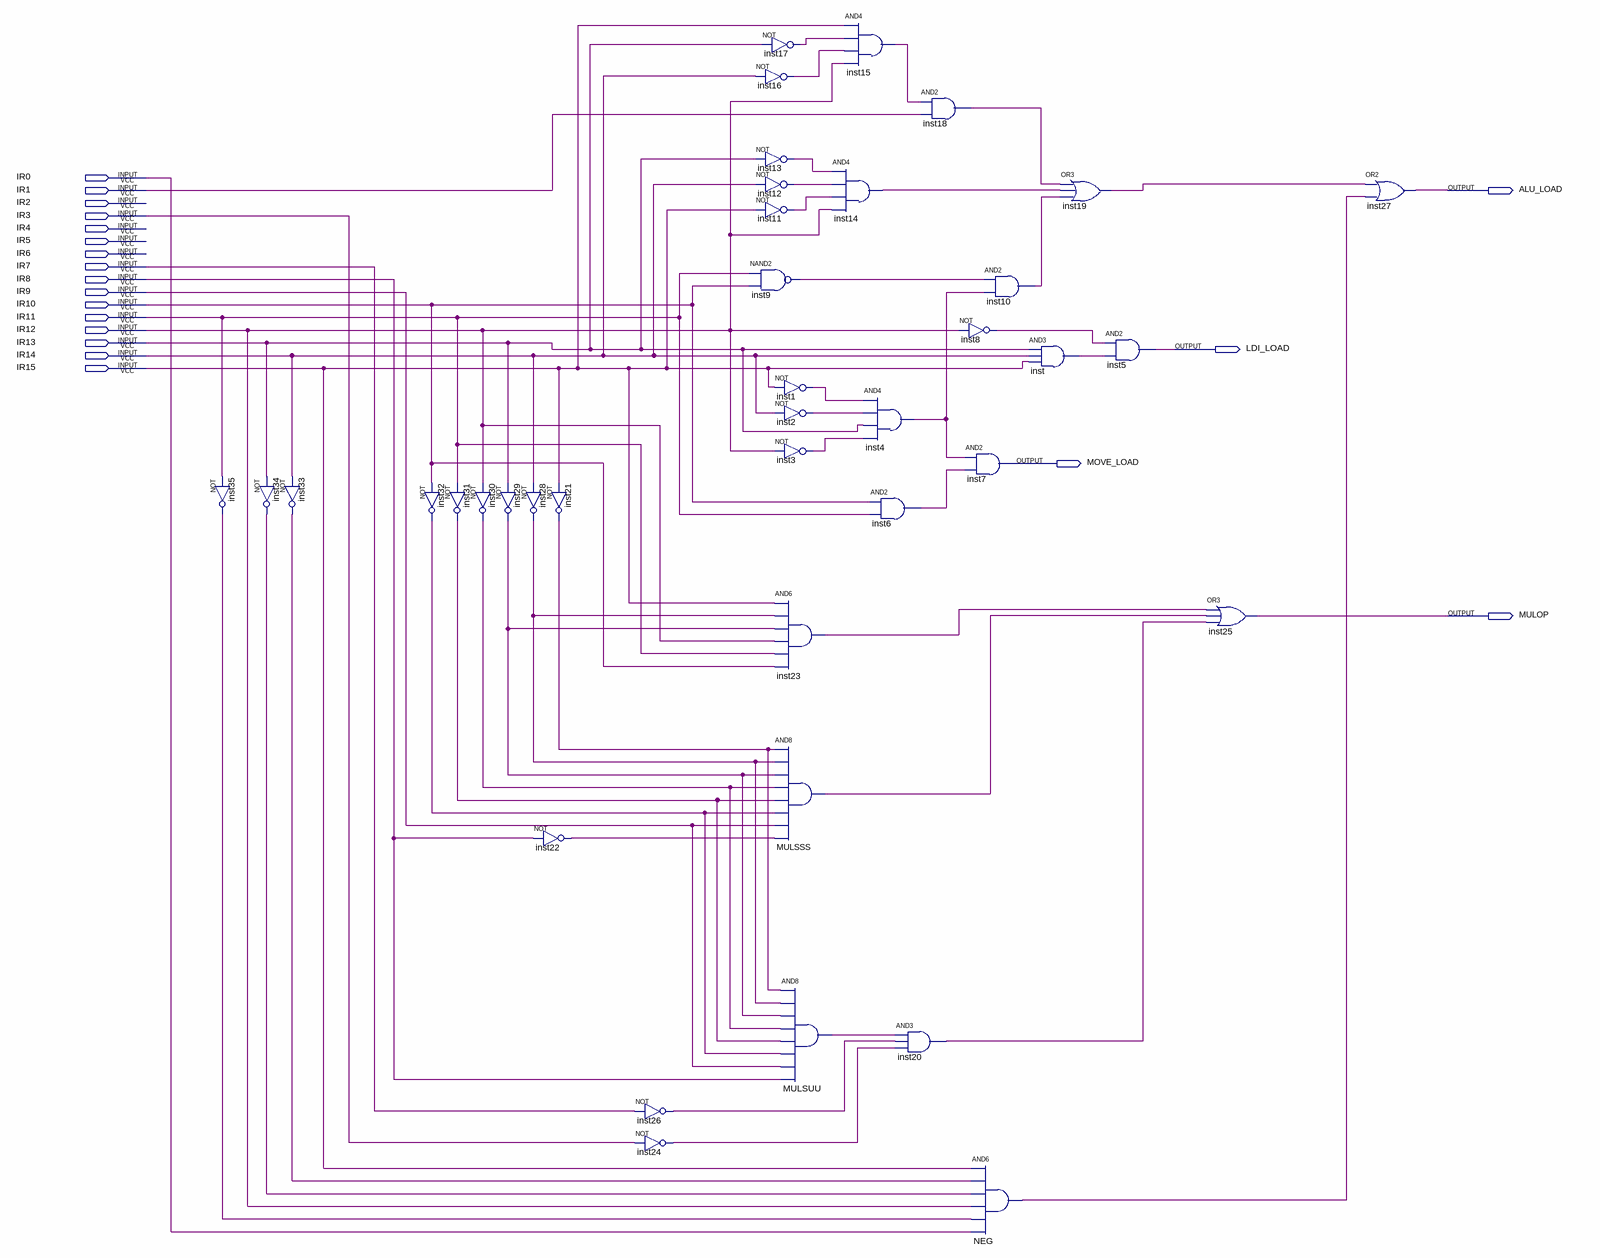
[diagram p0: schematic sheet]
// Quartus schematic LOAD_SELECT.bdf as structural Verilog: 39 symbols, 20 pins
module LOAD_SELECT (
  input  IR0,
  input  IR1,
  input  IR2,
  input  IR3,
  input  IR4,
  input  IR5,
  input  IR6,
  input  IR7,
  input  IR8,
  input  IR9,
  input  IR10,
  input  IR11,
  input  IR12,
  input  IR13,
  input  IR14,
  input  IR15,
  output ALU_LOAD,
  output LDI_LOAD,
  output MOVE_LOAD,
  output MULOP
);

  wire inst1_out, inst2_out, inst3_out, inst4_out, inst6_out, inst8_out, inst9_out, inst10_out, inst11_out,
       inst12_out, inst13_out, inst14_out, inst15_out, inst16_out, inst17_out, inst18_out, inst19_out,
       inst20_out, inst21_out, inst22_out, inst23_out, inst24_out, inst26_out, inst28_out, inst29_out,
       inst30_out, inst31_out, inst32_out, inst33_out, inst34_out, inst35_out, inst_out, MULSSS_out,
       MULSUU_out, NEG_out;

  not inst35 (inst35_out, IR11);
  not inst33 (inst33_out, IR14);
  not inst34 (inst34_out, IR13);
  not inst31 (inst31_out, IR11);
  not inst32 (inst32_out, IR10);
  not inst29 (inst29_out, IR13);
  not inst30 (inst30_out, IR12);
  not inst21 (inst21_out, IR15);
  not inst28 (inst28_out, IR14);
  not inst22 (inst22_out, IR8);
  not inst26 (inst26_out, IR7);
  not inst24 (inst24_out, IR3);
  not inst16 (inst16_out, IR14);
  not inst13 (inst13_out, IR13);
  not inst12 (inst12_out, IR14);
  not inst11 (inst11_out, IR15);
  nand inst9 (inst9_out, IR11, IR10);
  not inst17 (inst17_out, IR13);
  not inst1 (inst1_out, IR15);
  not inst2 (inst2_out, IR14);
  not inst3 (inst3_out, IR12);
  and inst23 (inst23_out, IR15, inst28_out, inst29_out, IR12, IR11, IR10);
  and MULSSS (MULSSS_out, inst21_out, inst28_out, inst29_out, inst30_out, inst31_out, inst32_out, IR9, inst22_out);
  and MULSUU (MULSUU_out, inst21_out, inst28_out, inst29_out, inst30_out, inst31_out, inst32_out, IR9, IR8);
  and inst15 (inst15_out, IR15, inst17_out, inst16_out, IR12);
  and inst14 (inst14_out, inst13_out, inst12_out, inst11_out, IR12);
  and inst4 (inst4_out, inst1_out, inst2_out, IR13, inst3_out);
  and inst6 (inst6_out, IR10, IR11);
  and inst20 (inst20_out, MULSUU_out, inst26_out, inst24_out);
  and inst18 (inst18_out, inst15_out, IR1);
  not inst8 (inst8_out, IR12);
  and inst10 (inst10_out, inst9_out, inst4_out);
  and inst7 (MOVE_LOAD, inst4_out, inst6_out);
  and NEG (NEG_out, IR15, inst33_out, inst34_out, IR12, inst35_out, IR0);
  or inst19 (inst19_out, inst18_out, inst14_out, inst10_out);
  and inst (inst_out, IR13, IR14, IR15);
  and inst5 (LDI_LOAD, inst8_out, inst_out);
  or inst25 (MULOP, inst23_out, MULSSS_out, inst20_out);
  or inst27 (ALU_LOAD, inst19_out, NEG_out);
endmodule
